# EAGLE design dc-isolation (EAGLE 5.07)
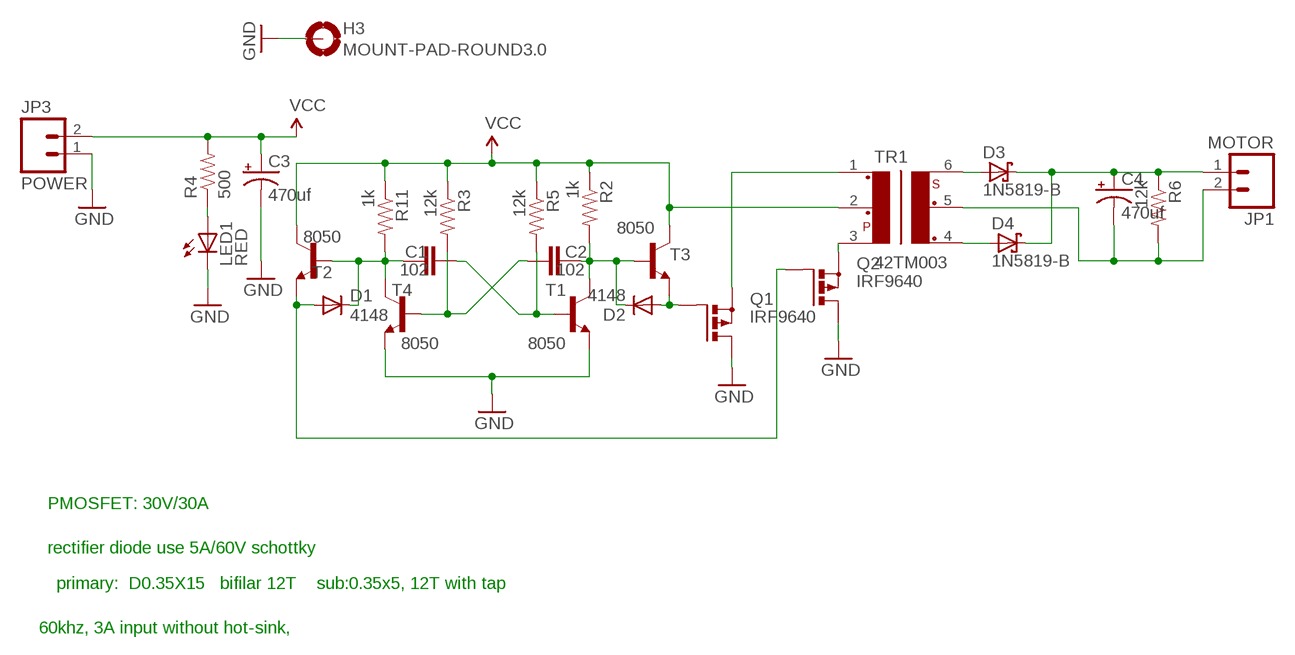
[diagram p0: schematic, sheet 1]

## Parts
C1  102  CAPPTH  [CAP-PTH-SMALL]
C2  102  CAPPTH  [CAP-PTH-SMALL]
C3  470uf  CAP_POLPTH1  [CPOL-RADIAL-100UF-25V]
C4  470uf  CAP_POLPTH1  [CPOL-RADIAL-100UF-25V]
D1  4148  DIODE1N4148  [DIODE-1N4148]
D2  4148  DIODE1N4148  [DIODE-1N4148]
D3  1N5819-B  [DO41-7.6]
D4  1N5819-B  [DO41-7.6]
H3  MOUNT-PAD-ROUND3.0  [3,0-PAD]
JP1  MOTOR  CON-02-XH  [XH-1X2-LONG-LOCK]
JP3  POWER  CON-02-XH  [XH-1X2-LONG-LOCK]
LED1  RED  LED3MM  [LED3MM]
Q1  IRF9640  PMOSFET_PTO220BH  [TO220BH]
Q2  IRF9640  PMOSFET_PTO220BH  [TO220BH]
R2  1k  RESISTOR1/4W  [AXIAL-0.3]
R3  12k  RESISTOR1/4W  [AXIAL-0.3]
R4  500  RESISTOR1/4W  [AXIAL-0.3]
R5  12k  RESISTOR1/4W  [AXIAL-0.3]
R6  12k  RESISTOR1/4W  [AXIAL-0.3]
R11  1k  RESISTOR1/4W  [AXIAL-0.3]
T1  8050  90**-NPN-TO92-EBC  [TO92-EBC]
T2  8050  90**-NPN-TO92-EBC  [TO92-EBC]
T3  8050  90**-NPN-TO92-EBC  [TO92-EBC]
T4  8050  90**-NPN-TO92-EBC  [TO92-EBC]
TR1  42TM003  [42TM]

## Nets
GND: C3.2(-) H3.B3,0(MOUNT) JP3.1 LED1.K(C) Q1.D Q2.D T1.E T4.E
N$1: LED1.A R4.P$1
N$2: D1.A Q2.G T2.E
N$3: Q1.S TR1.1
N$5: Q2.S TR1.3
N$6: C1.1 D1.C R11.P$2 T2.B T4.C
N$8: C2.1 R3.P$2 T4.B
N$9: C1.2 R5.P$2 T1.B
N$10: C2.2 D2.C R2.P$2 T1.C T3.B
N$11: D2.A Q1.G T3.E
N$13: D3.A TR1.6
N$14: C4.2(-) JP1.2 R6.P$2 TR1.5
N$15: C4.1(+) D3.C D4.C JP1.1 R6.P$1
N$16: D4.A TR1.4
VCC: C3.1(+) JP3.2 R2.P$1 R3.P$1 R4.P$2 R5.P$1 R11.P$1 T2.C T3.C TR1.2

## Notes on the sheet
- PMOSFET: 30V/30A
- rectifier diode use 5A/60V schottky
- primary:  D0.35X15   bifilar 12T    sub:0.35x5, 12T with tap
- 60khz, 3A input without hot-sink,

## Library data of the parts
C1 C2 = digital-toy:CAP: Capacitor Standard 0603 ceramic capacitor, and 0.1" leaded capacitor.
C3 C4 = digital-toy:CAP_POL: Capacitor Polarized These are standard SMD and PTH capacitors. Normally 10uF, 47uF, and 100uF in electrolytic and tantalum varieties. Always verify the external diameter of the through hole cap, it varies with capacity, voltage, and manufacturer. The EIA devices should be standard. PANASONIC_D size: 6.5mmx6.5mmx5.5mm, 100uf (taobao:6.3mmx5.5mm), same as CVL0605 153cvl0405 size: 4mmx4mmx5.5mm, 10uf (taobao:4mmx5.5mm)
D1 D2 = digital-toy:DIODE: Diode These are standard reverse protection diodes and small signal diodes. SMA package can handle up to about 1A. SOD-323 can handle about 200mA. What the SOD-323 package when ordering, there are some mfgs out there that are 5-pin packages.
D3 D4 = digital-toy:1N581*: 1.0A SCHOTTKY BARRIER RECTIFIER Source: http://www.diodes.com/datasheets/ds23001.pdf
H3 = holes:MOUNT-PAD-ROUND: MOUNTING PAD, round
JP1 JP3 = digital-toy:CON-02: Header 2 Standard 2-pin 0.1" header. Use with straight break away headers (SKU : PRT-00116), right angle break away headers (PRT-00553), swiss pins (PRT-00743), machine pins (PRT-00117), and female headers (PRT-00115). Molex polarized connector foot print use with SKU : PRT-08233 with associated crimp pins and housings.
LED1 = digital-toy:LED: LEDs Standard schematic elements and footprints for 5mm, 3mm, 1206, and 0603 sized LEDs. 5mm - Spark Fun Electronics SKU : COM-00529 (and others) copy led.lbr 0805 led here, by hyl digital-toy. 2010.6.29
Q1 Q2 = transistor-power:PMOSFET_P: Power MOSFET P-Channel
R2-R6 R11 = digital-toy:RESISTOR: Resistor Basic schematic elements and footprints for 0603, 1206, and PTH 1/10th watt (small) resistors. digital-toy copy vertical mount of axial-0.3 from rcl.lbr : the 0207/xx
T1-T4 = digital-toy:*-NPN-: NPN Transistror most of sot-23 use the pacages sot23-BEC, top C, left B, right E. by hyl, digital-toy. and to-92 use ebc(from-top) by hyl, digital-toy.
TR1 = trafo-xicon:42T?*: Xicon Micro-Mini EI-12 Audio Transformers 42TL/42TC/42TM Series Source: http://www.mouser.com//catalog/specsheets/164201.pdf http://www.mouser.com/catalog/specsheets/114225.pdf http://www.mouser.com/catalog/specsheets/164267.pdf

## Board
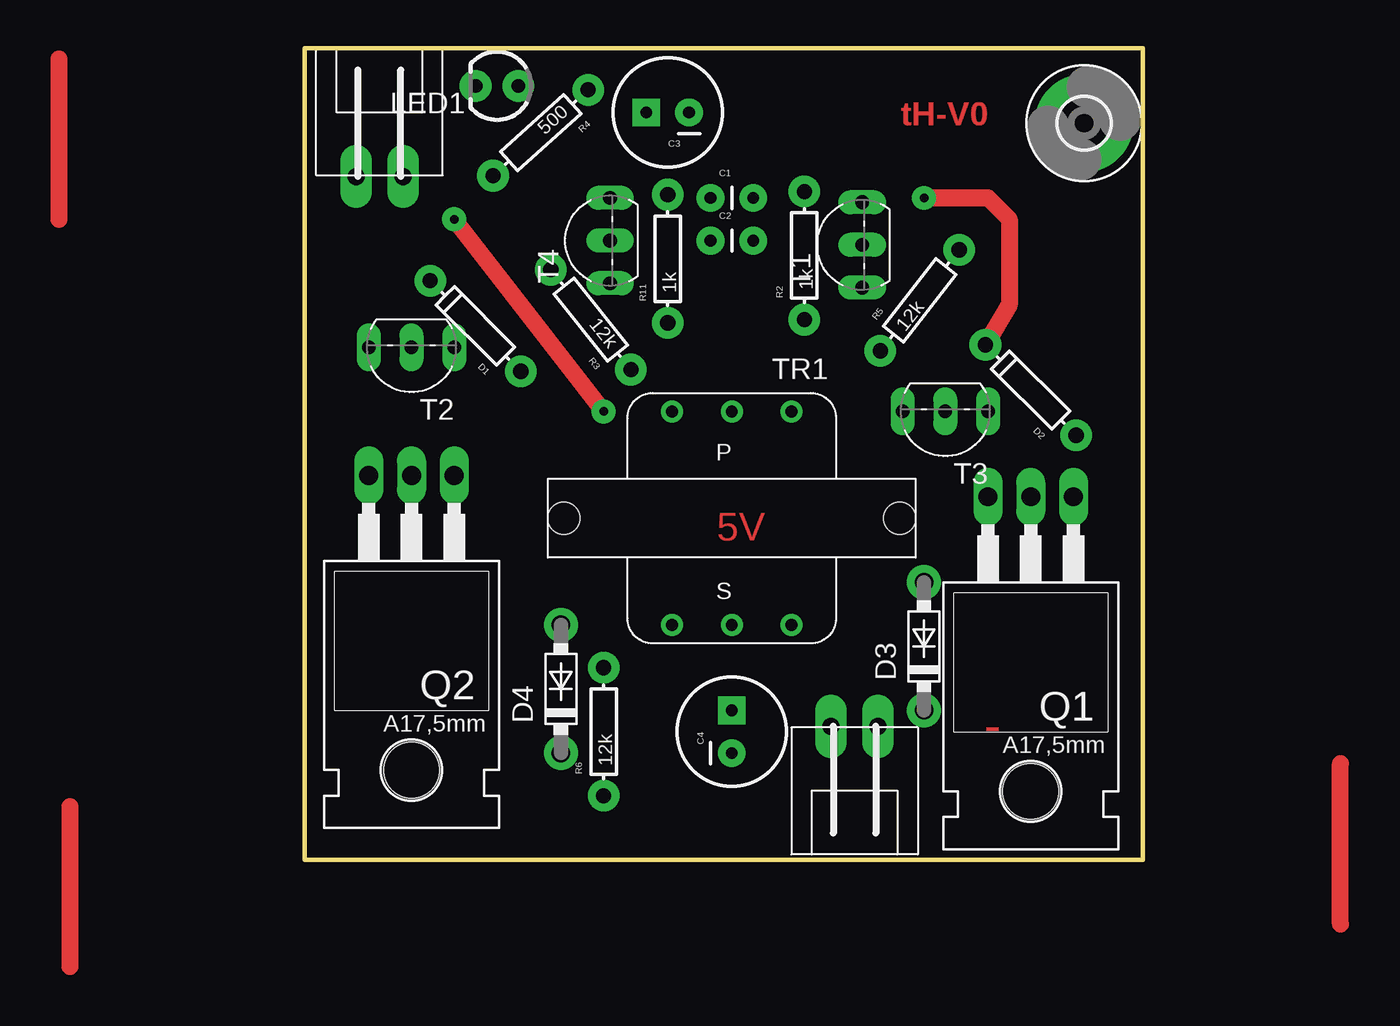
[diagram p1: board, top side]
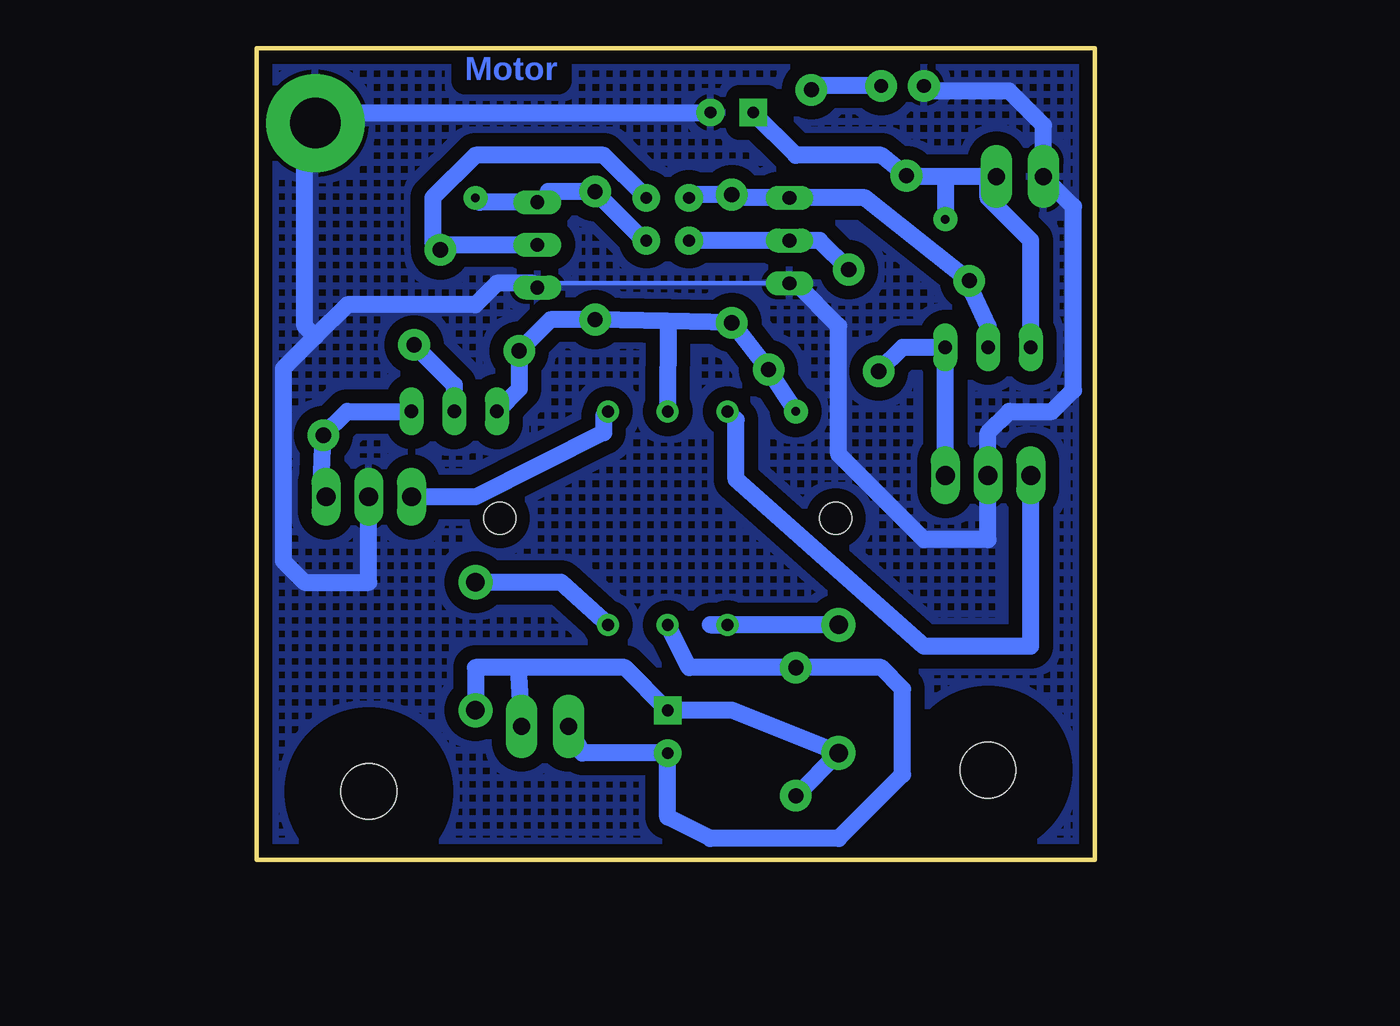
[diagram p2: board, bottom side, seen from below]

Size 49.85 x 48.26 mm. Coordinates in mm from the lower left corner, seen from the top.
Outline: 0,0 49.85,0 49.85,48.26 0,48.26 0,0
Copper layers (1*16): Top 0.035mm / dielectric 1.5mm / Bottom 0.035mm
Design rules "SparkFun-HP1007-600x600dpi": minimum track width 10mil, minimum drill 20mil, track to track 12mil, track to pad 12mil, pad to pad 12mil, via to via 12mil, smd to smd 12mil, copper to edge 12mil, drill to drill 12mil, minimum pad ring 12mil, minimum via ring 10mil, stop-mask expansion 4mil, vias tented up to drill 25mil, thermal gap 10mil

### Footprints (pad centres in the part's own frame; a part is rotated, then mirrored left to right if it is on the bottom)
CAP-PTH-SMALL = drill 0.7 pad 1.651 round: 1 0,0; 2 2.54,0
CPOL-RADIAL-100UF-25V = drill 0.7 pad 1.651 square: 1 1.27,0 | drill 0.7 pad 1.651 round: 2 -1.27,0
DIODE-1N4148 = drill 0.9 pad 1.88 round: A -3.81,0; C 3.81,0
DO41-7.6 = drill 1.1 pad 2.032 round: A 3.81,0; C -3.81,0
3,0-PAD = drill 3 pad 5.842 round: B3,0 0,0
XH-1X2-LONG-LOCK = drill 1.016 pad 1.88 long: 1 -1.397,0; 2 1.397,0
LED3MM = drill 0.813 pad 1.88 round: A -1.27,0; K 1.27,0
TO220BH = drill 1.118 long: D 0,-6.35; G -2.54,-6.35; S 2.54,-6.35 | hole 3.302: 0,11.176
AXIAL-0.3 = drill 0.9 pad 1.88 round: P$1 -3.81,0; P$2 3.81,0
TO92-EBC = drill 0.813 long: B 0,-1.27; C 2.54,-1.27; E -2.54,-1.27
42TM = drill 0.7 pad 1.3 round: 1 -3.556,-6.35; 2 0,-6.35; 3 3.556,-6.35; 4 3.556,6.35; 5 0,6.35; 6 -3.556,6.35 | hole 1.9: -9.982,0; 9.982,0

### Placement (x,y rotation side)
C1  24.13,39.37 0 top
C2  24.13,36.83 0 top
C3  [CPOL-RADIAL-100UF-25V]  21.59,44.45 180 top
C4  [CPOL-RADIAL-100UF-25V]  25.4,7.62 90 top
D1  [DIODE-1N4148]  10.16,31.75 135 top
D2  [DIODE-1N4148]  43.18,27.94 135.1 top
D3  36.83,12.7 90 top
D4  15.24,10.16 90 top
H3  46.35,43.81 0 top
JP1  32.7,7.94 180 top
JP3  4.45,40.64 0 top
LED1  11.43,46.04 180 top
Q1  43.18,15.24 180 top
Q2  6.35,16.51 180 top
R2  29.72,35.94 90 top
R3  17.02,32.13 128.7 top
R4  14.03,43.24 222.1 top
R5  36.58,33.27 52 top
R6  17.78,7.62 90 top
R11  21.59,35.75 90 top
T1  31.88,36.58 90 top
T2  6.35,29.21 180 top
T3  38.1,25.4 180 top
T4  16.89,36.83 90 top
TR1  25.4,20.32 180 top

### Tracks (layer width: path | path; a pad name or v marks a point on that pad's centre or on a via)
GND
  Bottom 0.254: T1.E 32.89,34.29 T4.E 17.78,34.29 | 9.84,45.72 LED1.K
  Bottom 1.016: Q1.D 43.18,16.51 46.99,16.51 48.26,17.78 48.26,29.21 46.35,31.11 | 46.35,31.11 44.45,33.02 36.83,33.02 35.56,34.29 33.4,34.29 T1.E | 17.78,34.29 15.24,31.75 15.24,24.13 10.16,19.05 6.35,19.05 Q2.D 6.35,25.4 5.08,26.67 2.54,26.67 1.27,27.94 1.27,38.86 JP3.1 3.05,43.69 5.08,45.72 9.84,45.72 | 46.35,31.11 46.99,31.75 46.99,43.18 H3.B3,0 46.99,44.45 C3.2
  pour Bottom (isolate 0.813, hatched): -11.11,62.55 63.18,63.5 66.04,-6.67 -11.75,-5.71
  pour Top (isolate 0.813, hatched): 64.14,-11.11 66.67,-23.81 -6.99,-27.62 -6.67,-12.06 -4.13,-13.34
N$1
  Bottom 1.016: LED1.A 16.62,46.04 R4.P$1
N$2
  Bottom 1.016: Q2.G T2.E 11.43,30.48 D1.A
N$3
  Bottom 1.016: Q1.S 36.83,21.59 29.21,25.4 29.21,26.42 TR1.1
N$5
  Bottom 1.016: Q2.S 3.81,12.7 10.16,12.7 21.34,22.61 21.34,26.16 TR1.3
N$6
  Bottom 0.254: 21.59,39.37 R11.P$2 | 24.13,39.56 C1.1
  Bottom 1.016: 21.59,39.37 T4.C 13.66,39.37 D1.C 7.47,34.14 6.35,31.75 T2.B | R11.P$2 24.13,39.56
N$8
  Bottom 1.016: C2.1 T4.B 16.36,36.83 R3.P$2
N$9
  Bottom 0.254: R5.P$2 38.62,36.58
  Bottom 1.016: C1.2 29.21,41.91 36.83,41.91 39.37,39.37 39.37,36.73 R5.P$2 | 38.62,36.58 T1.B
N$10  (via drill 0.51 pad 1.42)
  Top 1.016: D2.C 41.91,33.02 41.91,38.1 40.64,39.37 v36.83,39.37
  Bottom 0.254: C2.2 26.8,36.83 | 32.51,39.75 T1.C
  Bottom 1.016: 26.8,36.83 R2.P$2 32.51,39.75 | T3.B 38.1,28.25 D2.C | T1.C 36.58,39.12 v36.83,39.37
N$11
  Bottom 0.254: Q1.G 46.03,21.59
  Bottom 1.016: 46.03,21.59 D2.A 44.46,26.67 T3.E
N$13
  Bottom 1.016: TR1.6 31.75,16.51 D3.A
N$14
  Bottom 1.016: JP1.2 30.48,6.35 C4.2 25.4,2.54 22.86,1.27 15.24,1.27 11.43,5.08 11.43,10.16 12.7,11.43 R6.P$2 24.13,11.43 TR1.5
N$15
  Bottom 1.016: R6.P$1 D4.C 21.59,8.89 C4.1 27.94,11.43 34.29,11.43 | 34.29,11.43 JP1.1 | 34.29,11.43 36.83,11.43 D3.C
N$16
  Bottom 1.016: D4.A 22.86,13.97 TR1.4
N$18
  Top 1.016: -14.61,38.1 -14.61,47.62
N$26
  Top 1.016: 61.59,-3.81 61.59,5.71
N$28
  Top 1.016: -13.97,3.17 -13.97,-6.35
VCC  (via drill 0.51 pad 1.42)
  Top 1.016: v8.89,38.1 v17.78,26.67
  Bottom 0.254: 11.16,40.64 R4.P$2
  Bottom 1.016: T3.C 34.23,28 R5.P$1 32.37,32.13 R2.P$1 25.39,32.03 | 6.35,40.64 8.89,40.64 | 6.35,40.64 JP3.2 | 8.89,40.64 11.16,40.64 | 8.89,40.64 v8.89,38.1 | v17.78,26.67 R3.P$1 R11.P$1 25.39,32.03 | C3.1 17.78,41.91 12.7,41.91 R4.P$2 | 25.39,32.03 TR1.2 | T2.C 3.81,36.83 6.35,39.37 6.35,40.64

### Text on the board
Top: tH-V0 | 5V | -
Bottom: Motor